# Altium schematic sheet Sheet1.SchDoc
size A
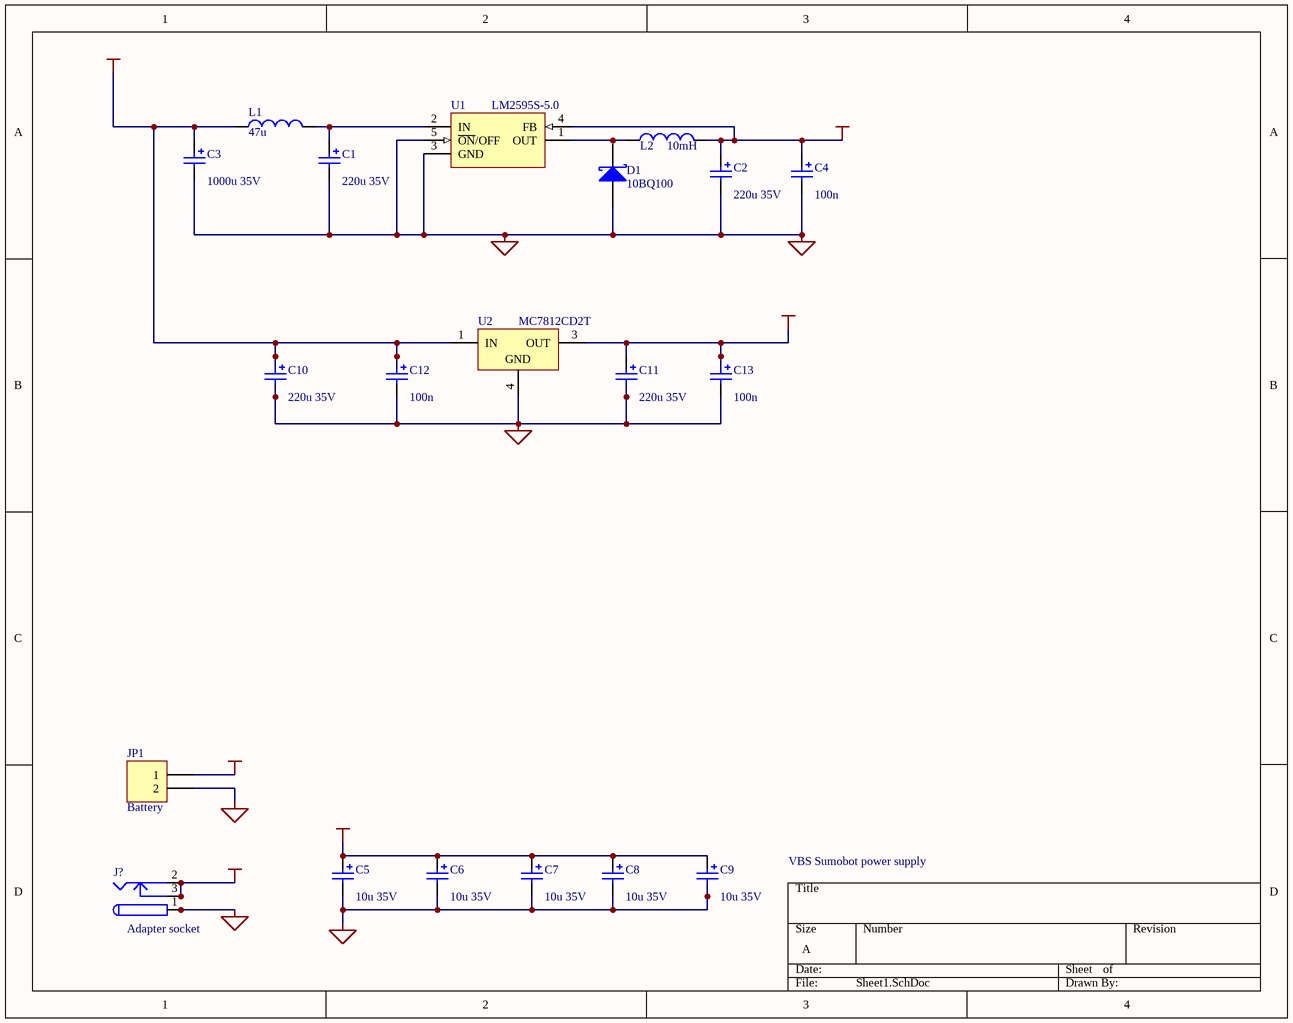
[diagram p0: Sheet1.SchDoc]

## Parts
C1  value 220u 35V  [RB7.6-15]  (hidden comment: Cap Pol1)
C2  value 220u 35V  [CAPPR7.5-16X35]  (hidden comment: Cap Pol1)
C3  value 1000u 35V  [RB7.6-15]  (hidden comment: Cap Pol1)
C4  value 100n  [CC2012-0805]  (hidden comment: Cap Pol3)
C5  value 10u 35V  [CC2012-0805]  (hidden comment: Cap Pol3)
C6  value 10u 35V  [CC2012-0805]  (hidden comment: Cap Pol3)
C7  value 10u 35V  [CC2012-0805]  (hidden comment: Cap Pol3)
C8  value 10u 35V  [CC2012-0805]  (hidden comment: Cap Pol3)
C9  value 10u 35V  [CC2012-0805]  (hidden comment: Cap Pol3)
C10  value 220u 35V  [RB7.6-15]  (hidden comment: Cap Pol1)
C11  value 220u 35V  [RB7.6-15]  (hidden comment: Cap Pol1)
C12  value 100n  [CC2012-0805]  (hidden comment: Cap Pol3)
C13  value 100n  [CC2012-0805]  (hidden comment: Cap Pol3)
D1  10BQ100  [SMB]
J?  PWR2.5  [KLD-0202]  (value not drawn)
JP1  Header 2  [HDR1X2]  (value not drawn)
L1  value 47u  [C1005-0402]  (hidden comment: Inductor)
L2  value 10mH  [C1005-0402]  (hidden comment: Inductor)
U1  LM2595S-5.0  [TS5B]
U2  MC7812CD2T  [936-03]

## Nets
0V: C1.2 C2.2 C3.2 C4.2 C10.2 C11.2 C12.2 C13.2 D1.1(A) J?.1 J?.1A J?.1B JP1.2 U1.3(GND) U1.5(~{ON}/OFF) U2.4(GND)
+5 V: C2.1 C4.1 C5.1 C6.1 C7.1 C8.1 C9.1 L2.2 U1.4(FB)
+12V: C11.1 C13.1 U2.3(OUT)
+24 V: J?.2 J?.2A J?.2B J?.3 J?.3A J?.3B JP1.1
+24V: C3.1 C10.1 C12.1 L1.1 U2.1(IN)
SGND: C5.2 C6.2 C7.2 C8.2 C9.2
NetC1_1: C1.1 L1.2 U1.2(IN)
NetD1_2: D1.2(K) L2.1 U1.1(OUT)

## Notes on the sheet
- (near JP1) Battery
- VBS Sumobot power supply
- (near J?) Adapter socket

## Library data of the parts
C1-C3 C10 C11 = Cap Pol1: Polarized Capacitor (Radial); Published: 8-Jun-2000; Revision: July-2002: Re-released for DXP Platform.; Publisher: Altium Limited
C4-C9 C12 C13 = Cap Pol3: Polarized Capacitor (Surface Mount); Published: 8-Jun-2000; Revision: July-2002: Re-released for DXP Platform.; Publisher: Altium Limited
D1 = 10BQ100: Schottky Rectifier; Revision 1: 10-Jul-2000: SIM Model Added.; Revision 2: 17-Jul-2002: Re-released for DXP Platform.; Published: 8-Jun-2000; Datasheet: Latest Revision: PD-2.437A; Package Reference: SMB; Publisher: Altium Limited
J? = PWR2.5: Low Voltage Power Supply Connector; Published: 17-Dec-2003; Datasheet: Latest Revision: 09-May-2002; Publisher: Altium Limited
JP1 = Header 2: Header, 2-Pin; Revision: 17-Jul-2002: Re-released for DXP Platform.; Publisher: Altium Limited
U1 = LM2595S-5.0: Simple Switcher Power Converter 150 kHz 1A Step Down Voltage Regulator; Note: Tab is connected to GND; Published: 15-Apr-2002; Datasheet: Latest Revision: May-1999; Package Reference: TS5B; Publisher: Altium Limited
U2 = MC7812CD2T: Three-Terminal Positive Voltage Regulator; Package Information: Latest Revision: 1997; Note: Pin 2 is electrically connected to Pin 4; Pin 2 is trimmed and not drawn;; Published: 15-Apr-2002; Datasheet: Latest Revision: 1997; Package Reference: 936-03; Publisher: Altium Limited
L1 L2 = Inductor: Published: 8-Jun-2000; Revision: July-2002: Re-released for DXP Platform.; Publisher: Altium Limited